# EAGLE design GPS Ant 1575 (EAGLE 7.2.0)
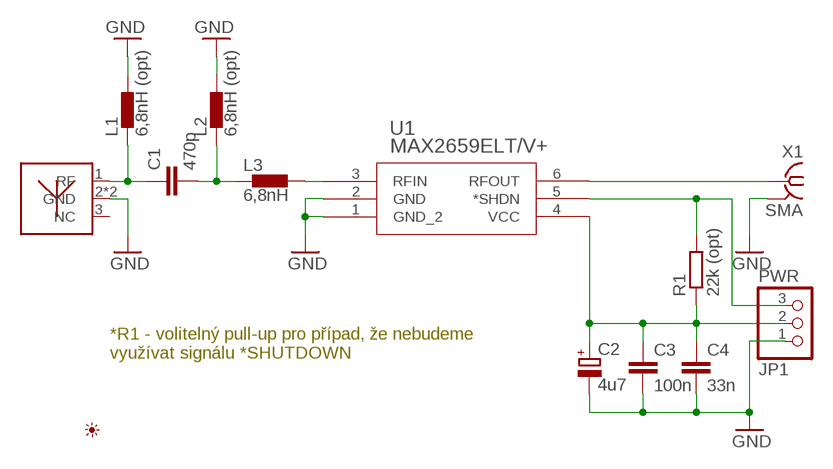
[diagram p0: schematic, sheet 1]

## Parts
ANT1  1575AT54A0010  [1575AT54A0010]
C1  470p  C-EUC0603  [C0603]
C2  4u7  CPOL-EUSMCA  [SMC_A]
C3  100n  C-EUC0603  [C0603]
C4  33n  C-EUC0603  [C0603]
JP1  PWR  PINHD-1X3  [1X03]
L1  6,8nH (opt)  BLM15HB121SN1  [0402]
L2  6,8nH (opt)  BLM15HB121SN1  [0402]
L3  6,8nH  BLM15HB121SN1  [0402]
PICTO1  PICTO_1  [PICTO_1]
R1  22k (opt)  R-EU_R0603  [R0603]
U1  MAX2659ELT/V+  [21-0147E]
X1  SMA  SMA-142-0701-801/806  [J502-ND-142-0701-801/806]

## Nets
GND: ANT1.2(GND) ANT1.4(GND) C2.- C3.2 C4.2 JP1.1 L1.2 L2.2 U1.1(GND_2) U1.2(GND) X1.G@1 X1.G@2 X1.G@3 X1.G@4
N$1 [RF]: ANT1.1(RF) C1.1 L1.1
N$2 [RF]: C1.2 L2.1 L3.1
N$3 [RF]: L3.2 U1.3(RFIN)
N$4 [RF]: U1.6(RFOUT) X1.1
SHDN: JP1.3 R1.2 U1.5(*SHDN)
VCC: C2.+ C3.1 C4.1 JP1.2 R1.1 U1.4(VCC)
Unconnected: ANT1.3(NC)

## Notes on the sheet
- *R1 - volitelný pull-up pro případ, že nebudeme
  využívat signálu *SHUTDOWN

## Library data of the parts
ANT1 = Johanson Technology:1575AT54A0010: 1.575 & 1.602 GHz GPS/GLONASS SMD Chip Antenna
C1 C3 C4 = rcl:C-EU: CAPACITOR, European symbol
C2 = rcl:CPOL-EU: POLARIZED CAPACITOR, European symbol
JP1 = pinhead:PINHD-1X3: PIN HEADER
L1-L3 = inductors:BLM15H: EMIFIL (R) Chip Ferrite Bead for GHz Noise Source: http://www.murata.com/ Ferrite Bead BLM15H.pdf
PICTO1 = My_Picto:PICTO_1: Zdenek Brichacek; OK3ZB; http://blog.brichacek.net
R1 = rcl:R-EU_: RESISTOR, European symbol
U1 = Maxim, Dallas:MAX2659ELT/V+; MANUFACTURER_NAME: Maxim; MANUFACTURER_PART_NUMBER: MAX2659ELT/V+; VENDOR: Maxim
X1 = con-coax:SMA-: SMA 50 Ohm End Launch Jack Receptacle - Round Contact Johnson Components Source: www.johnsoncomponents.com .. J502-ND.pdf; MF: JOHNSON COMPONENTS; MPN: 142-0701-801; OC_FARNELL: 1608592; OC_NEWARK: 90F2624

## Net classes
1 RF: width 2.4 mm, clearance 0.406 mm
2 net: width 0.6 mm, clearance 0.254 mm

## Board
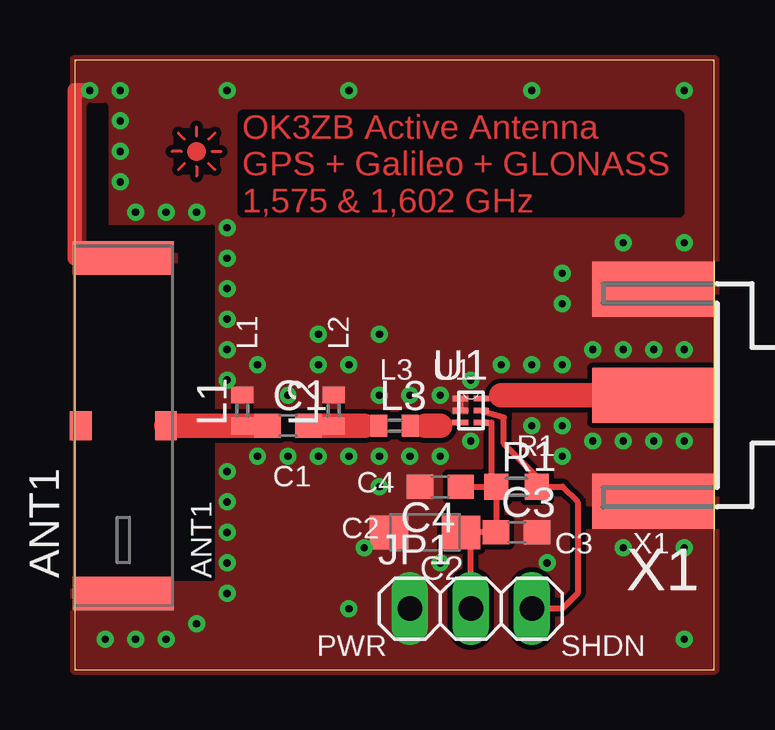
[diagram p1: board, top side]
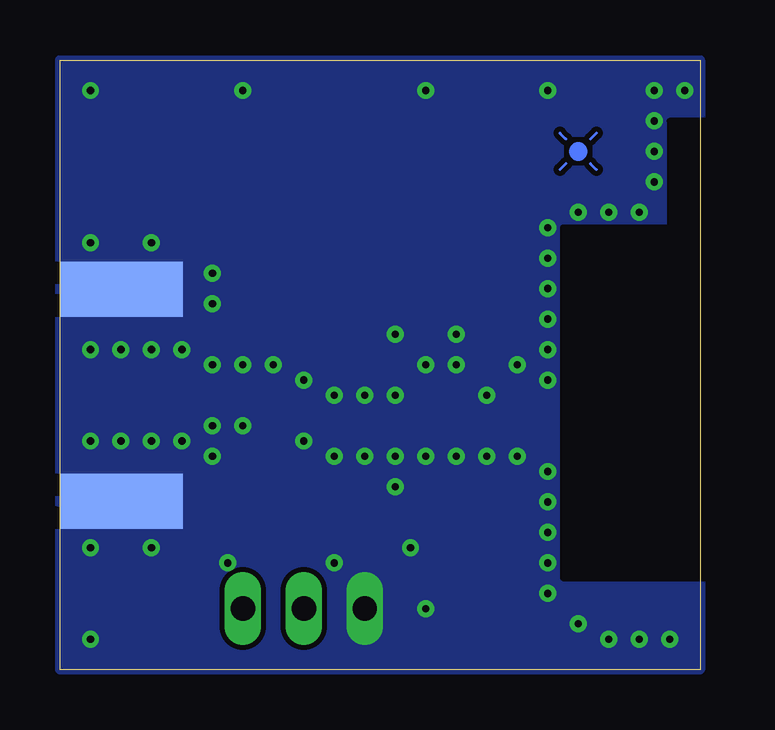
[diagram p2: board, bottom side, seen from below]

Size 26.67 x 25.4 mm. Coordinates in mm from the lower left corner, seen from the top.
Outline: 0,0 26.65,0 26.65,25.4 0,25.4 0,0
Copper layers (1*16): Top 0.035mm / dielectric 1.5mm / Bottom 0.035mm
Design rules "default *": minimum track width 10mil, minimum drill 24mil, track to track 8mil, track to pad 8mil, pad to pad 8mil, via to via 8mil, smd to smd 8mil, copper to edge 0mil, drill to drill 8mil, minimum pad ring 10mil, minimum via ring 8mil, stop-mask expansion 4mil, vias tented up to drill 0mil, thermal gap 0mil

### Footprints (pad centres in the part's own frame; a part is rotated, then mirrored left to right if it is on the bottom)
1575AT54A0010 = smd 1.2 x 0.9: 1 0,0; 3 0,3.556 | smd 1.4 x 4.2: 2 -6.985,1.778; 4 6.985,1.778
C0603 = smd 1.1 x 1: 1 -0.85,0; 2 0.85,0
SMC_A = smd 1.6 x 1.4: + -1.5,0; - 1.5,0
1X03 = drill 1.016 long: 1 -2.54,0; 2 0,0; 3 2.54,0
0402 = smd 0.7 x 0.9: 1 -0.65,0; 2 0.65,0
R0603 = smd 1 x 1.1: 1 -0.85,0; 2 0.85,0
21-0147E = smd 0.635 x 0.229: 1 -0.432,0.508; 2 -0.432,0; 3 -0.432,-0.508; 4 0.432,-0.508; 5 0.432,0; 6 0.432,0.508
J502-ND-142-0701-801/806 = smd 5.08 x 2.286: 1 2.565,0; G@1 2.565,4.42; G@2 2.565,-4.42 | smd 5.08 x 2.286 bottom: G@3 2.565,4.42; G@4 2.565,-4.42

### Placement (x,y rotation side)
ANT1  3.81,10.16 90 top
C1  8.89,10.16 0 top
C2  14.61,5.71 180 top
C3  18.41,5.71 0 top
C4  15.24,7.62 180 top
JP1  16.51,2.54 0 top
L1  6.99,10.79 90 top
L2  10.79,10.79 90 top
L3  13.34,10.16 0 top
PICTO1  5.08,21.59 0 top
R1  18.41,7.62 0 top
U1  16.51,10.79 0 top
X1  26.67,11.43 180 top

### Tracks (layer width: path | path; a pad name or v marks a point on that pad's centre or on a via)
GND  (via drill 0.3)
  Top 0.254: U1.2 U1.1
  Top 0.61: ANT1.4 0,17.14 0,24.13 v0.64,24.13
  other vias: 6.35,17.14 6.35,15.88 6.35,14.61 6.35,13.34 6.35,12.06 7.62,12.7 8.89,11.43 10.16,12.7 11.43,12.7 12.7,11.43 13.97,11.43 15.24,11.43 16.51,12.06 17.78,12.7 19.05,12.7 20.32,12.7 21.59,13.34 22.86,13.34 24.13,13.34 25.4,13.34 1.27,1.27 2.54,1.27 3.81,1.27 5.08,1.91 6.35,18.41 6.35,3.17 6.35,4.45 6.35,5.71 6.35,6.99 6.35,8.26 7.62,8.89 8.89,8.89 10.16,8.89 11.43,8.89 12.7,8.89 13.97,8.89 15.24,8.89 16.51,9.53 19.05,10.16 20.32,10.16 21.59,9.53 22.86,9.53 24.13,9.53 25.4,9.53 20.32,15.24 20.32,16.51 22.86,17.78 25.4,17.78 20.32,8.89 22.86,5.08 25.4,5.08 12.06,5.08 12.7,7.62 15.24,4.45 10.16,13.97 12.7,13.97 6.35,24.13 11.43,2.54 11.43,24.13 25.4,24.13 25.4,1.27 19.68,4.45 19.05,24.13 5.08,19.05 3.81,19.05 2.54,19.05 1.91,20.32 1.91,21.59 1.91,22.86 1.91,24.13
  pour Top: 0,25.4 0,0 26.67,0 26.67,25.4
  pour Bottom: 0,25.4 0,0 26.67,0 26.67,25.4
N$1
  Top 0.254: L1.1 7,10.16 C1.1
  Top 0.305: 7.62,10.16 C1.1
  Top 1.016: ANT1.1 7.62,10.16
N$2
  Top 0.254: 10.16,10.16 10.18,10.14 L2.1
  Top 0.305: C1.2 10.16,10.16 | 12.06,10.16 L3.1
  Top 1.016: 10.16,10.16 12.06,10.16
N$3
  Top 0.254: U1.3 15.24,10.29 15.24,10.16
  Top 0.305: L3.2 14.61,10.16
  Top 1.016: 14.61,10.16 15.24,10.16
N$4
  Top 0.254: U1.6 17.78,11.3 17.78,11.43
  Top 1.016: 17.78,11.43 X1.1
N$5
  cutout Top: 4.45,17.78 0.64,17.78 0.64,23.5 1.27,23.5 1.27,18.41 5.71,18.41 5.71,3.81 0,3.81 0,16.51 4.45,16.51
N$6
  cutout Bottom: 0,22.86 1.27,22.86 1.27,18.41 5.71,18.41 5.71,3.81 0,3.81
SHDN
  Top 0.254: U1.5 17.89,10.51 17.89,9.42 19.27,8.04 R1.2 20.32,7.62 20.95,6.99 20.95,3.17 20.32,2.54 JP1.3
VCC
  Top 0.254: U1.4 17.36,10.29 17.36,7.83 R1.1 | C4.1 R1.1 | R1.1 C3.1 16.51,5.71 | 16.51,5.71 C2.+ | JP1.2 16.51,5.71

### Text on the board
Top: OK3ZB Active Antenna / GPS + Galileo + GLONASS / 1,575 & 1,602 GHz
_tNames: L1 | L2 | L3 | U1 | R1 | C1 | C4 | C2 | C3 | X1 | ANT1 | PWR | SHDN